# Altium project canh_nang_ha.PrjPcb
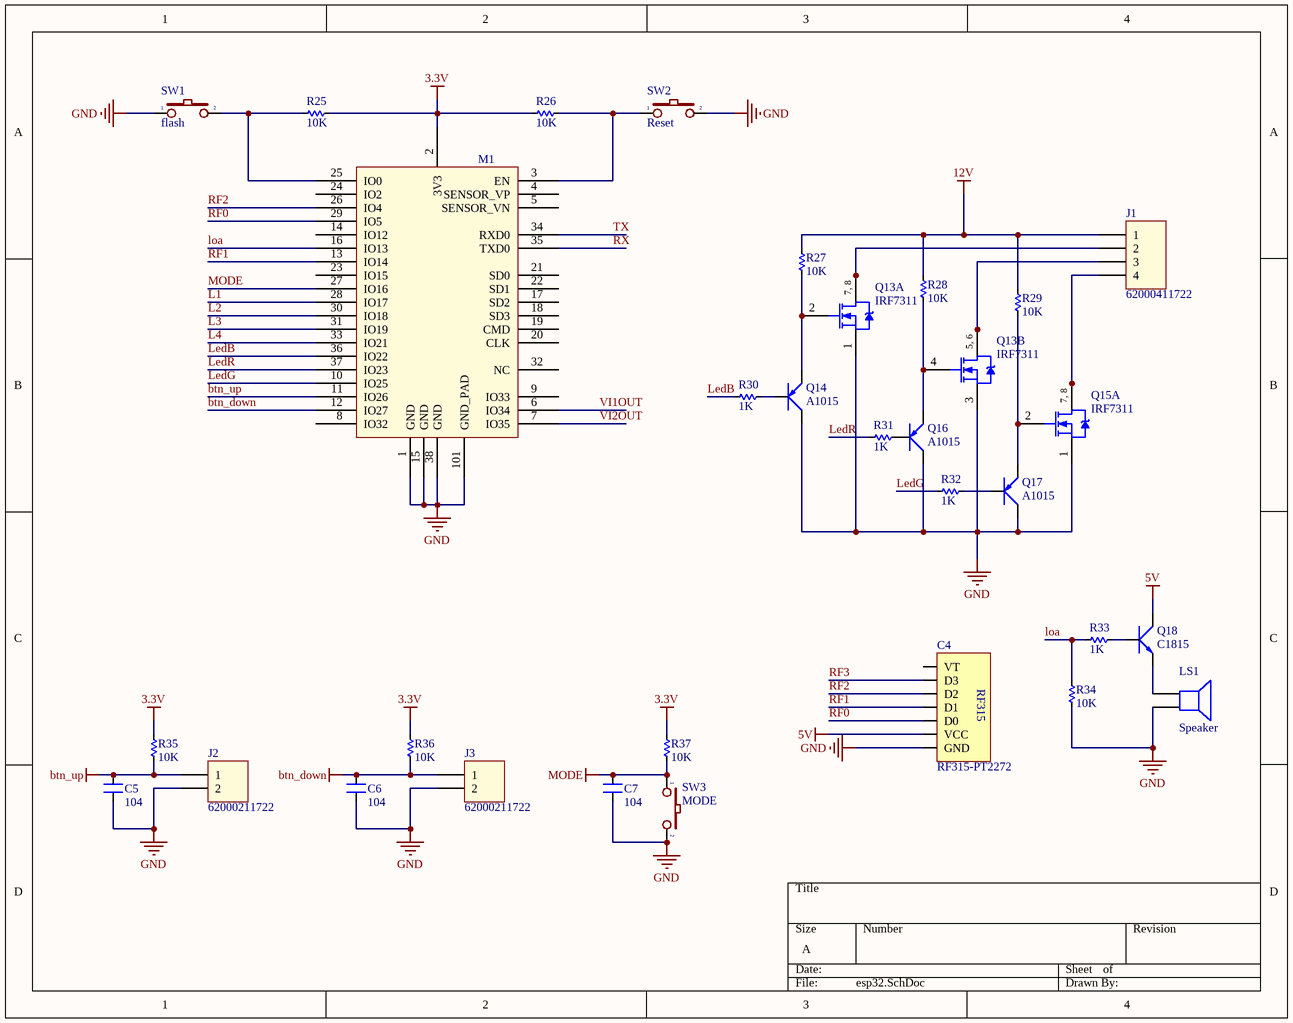
[diagram p0: esp32.SchDoc]
3 sheets, 96 parts. Net scope: global (net labels, ports and power ports of the same name join across sheets).
Board file: canh_nang_ha_pcb.PcbDoc
Sheets:
  esp32.SchDoc
  Bridge_H.SchDoc
  power.SchDoc

## Sheet esp32.SchDoc
size A

### Parts
C4  RF315-PT2272  [RF315-2272]
C5  104  [SM-CAP-0805]
C6  104  [SM-CAP-0805]
C7  104  [SM-CAP-0805]
J1  62000411722  [62000411722]
J2  62000211722  [62000211722]
J3  62000211722  [62000211722]
LS1  Speaker  [SPEAKER]
M1  ESP32S_Module  [ESP32S]  (value not drawn)
Q13  IRF7311  [SO-8_N]  (parts A,B of 2)
Q14  A1015  [SOT23B]
Q15  IRF7311  [SO-8_N]  (part A of 2)
Q16  A1015  [SOT23B]
Q17  A1015  [SOT23B]
Q18  C1815  [SOT23B]
R25  10K  [RES-SMD-0805]
R26  10K  [RES-SMD-0805]
R27  10K  [RES-SMD-0805]
R28  10K  [RES-SMD-0805]
R29  10K  [RES-SMD-0805]
R30  1K  [RES-SMD-0805]
R31  1K  [RES-SMD-0805]
R32  1K  [RES-SMD-0805]
R33  1K  [RES-SMD-0805]
R34  10K  [RES-SMD-0805]
R35  10K  [RES-SMD-0805]
R36  10K  [RES-SMD-0805]
R37  10K  [RES-SMD-0805]
SW1  flash  [SW-DIP1-1]
SW2  Reset  [SW1-SMD]
SW3  MODE  [SW-DIP1-1]

### Nets
3.3V: M1.2(3V3) R25.2 R26.1 R35.2 R36.2 R37.2
5V: C4.6(VCC) Q18.2(C)
12V: J1.1 R27.1 R28.1 R29.1
btn_down: C6.2 J3.1 M1.12(IO27) R36.1
btn_up: C5.2 J2.1 M1.11(IO26) R35.1
GND: C4.7(GND) C5.1 C6.1 C7.1 J2.2 J3.2 LS1.2 M1.1(GND) M1.15(GND) M1.38(GND) M1.101(GND_PAD) Q13.1(S) Q13.3(S) Q14.2(C) Q15.1(S) Q16.2(C) Q17.2(C) R34.2 SW1.1 SW2.2 SW3.2
MODE: C7.2 M1.27(IO16) R37.1 SW3.1
L1: M1.28(IO17)
L2: M1.30(IO18)
L3: M1.31(IO19)
L4: M1.33(IO21)
LedB: M1.36(IO22) R30.2
LedG: M1.10(IO25) R32.2
LedR: M1.37(IO23) R31.2
loa: M1.16(IO13) R33.2 R34.1
RF0: C4.5(D0) M1.29(IO5)
RF1: C4.4(D1) M1.13(IO14)
RF2: C4.3(D2) M1.26(IO4)
RF3: C4.2(D3)
RX: M1.35(TXD0)
TX: M1.34(RXD0)
VI1OUT: M1.6(IO34)
VI2OUT: M1.7(IO35)
NetJ1_2: J1.2 Q13.7(D) Q13.8(D)
NetJ1_3: J1.3 Q13.5(D) Q13.6(D)
NetJ1_4: J1.4 Q15.7(D) Q15.8(D)
NetLS1_1: LS1.1 Q18.1(E)
NetM1_3: M1.3(EN) R26.2 SW2.1
NetM1_25: M1.25(IO0) R25.1 SW1.2
NetQ13_2: Q13.2(G) Q14.1(E) R27.2
NetQ13_4: Q13.4(G) Q16.1(E) R28.2
NetQ14_3: Q14.3(B) R30.1
NetQ15_2: Q15.2(G) Q17.1(E) R29.2
NetQ16_3: Q16.3(B) R31.1
NetQ17_3: Q17.3(B) R32.1
NetQ18_3: Q18.3(B) R33.1

Not connected (* = marked no-connect by the designer): C4 1(VT); M1 4(SENSOR_VP) 5(SENSOR_VN) 8(IO32) 9(IO33) 14(IO12) 17(SD2) 18(SD3) 19(CMD) 20(CLK) 21(SD0) 22(SD1) 23(IO15) 24(IO2) 32(NC)

### Notes on the sheet
- (in symbol IRF7101, part A) 7, 8
- (in symbol IRF7101, part B) 5, 6
- (in symbol RF315-PT2272) RF315

### Library data of the parts
C4 = RF315-PT2272: Manufacturer: W¨¹rth Elektronik eiSos GmbH; partNo: 613004143121; ComponentLink1 Description: Manufacturer; ComponentLink2 Description: Datasheet; NoPins: 04; Created Date: 29 March 2013; ComponentLink1URL: http://www.we-online.com; ComponentLink2URL: http://katalog.we-online.de/em/datasheet/6130xx143121.pdf; Created by: Karrer Zheng
C5-C7 = CN: Value: 0,1uF/300V; Designed by: VanDungEvn
J1 = 62000411722: WR-WTB 2.00mm Male Horizontal Shrouded Header, 4p; Pin Number: 4; ComponentLink1Description: Manufacturer; ComponentLink1URL: http://www.we-online.de; ComponentLink2Description: Datasheet; ComponentLink2URL: http://katalog.we-online.de/em/datasheet/6200xx11722.pdf; Part Number: 62000411722; Published Date: June 2017; Publisher: Wurth Elektronik; Pitch: 2.00 mm
J2 J3 = 62000211722: WR-WTB 2.00mm Male Horizontal Shrouded Header, 2p; Pin Number: 2; ComponentLink1Description: Manufacturer; ComponentLink1URL: http://www.we-online.de; ComponentLink2Description: Datasheet; ComponentLink2URL: http://katalog.we-online.de/em/datasheet/6200xx11722.pdf; Part Number: 62000211722; Published Date: June 2017; Publisher: Wurth Elektronik; Pitch: 2.00 mm
LS1 = Speaker: Loudspeaker; Published: 24-Mar-1999; LatestRevisionDate: 17-Jul-2002; LatestRevisionNote: Re-released for DXP Platform.; PackageReference: PIN2; Publisher: Altium Limited
M1 = ESP32S_Module: Esp-32S; Datasheet: https://espressif.com/sites/default/files/documentation/esp_wroom_32_datasheet_en.pdf
Q13 Q15 = IRF7101: HEXFET Power MOSFET; Published: 8-Jun-2000; LatestRevisionDate: 13-Apr-2006; LatestRevisionNote: IPC-7351 Footprint Added.; DatasheetVersion: Aug-1997; PackageVersion: Feb-2001; PackageReference: SO-8; Publisher: Altium Limited; PackageDescription: 8-Pin Plastic Small Outline Integrated Circuit 1.27 mm Pitch; Code_JEDEC: MS-012-AA; Code_IPC: SOIC127P600-8; ComponentLink1Description: Manufacturer Link; ComponentLink1URL: http://www.irf.com/; ComponentLink2Description: Datasheet; ComponentLink2URL: http://www.irf.com/product-info/datasheets/data/irf7101.pdf
Q14 Q16 Q17 = A1015: PNP 600mW, ECB; Value: A1015
Q18 = C1815: NPN 600mW, ECB; Value: C1815
R25-R37 = Res-SMD: Resistor; Manufacturer: Generic Components; Class: Passive; Published: 08/06/2000; Publisher: Altium Hobart Technology Centre
SW1-SW3 = SW2: Switch button 2 pin; Value: SW chip 2 pin

## Sheet Bridge_H.SchDoc
size A3
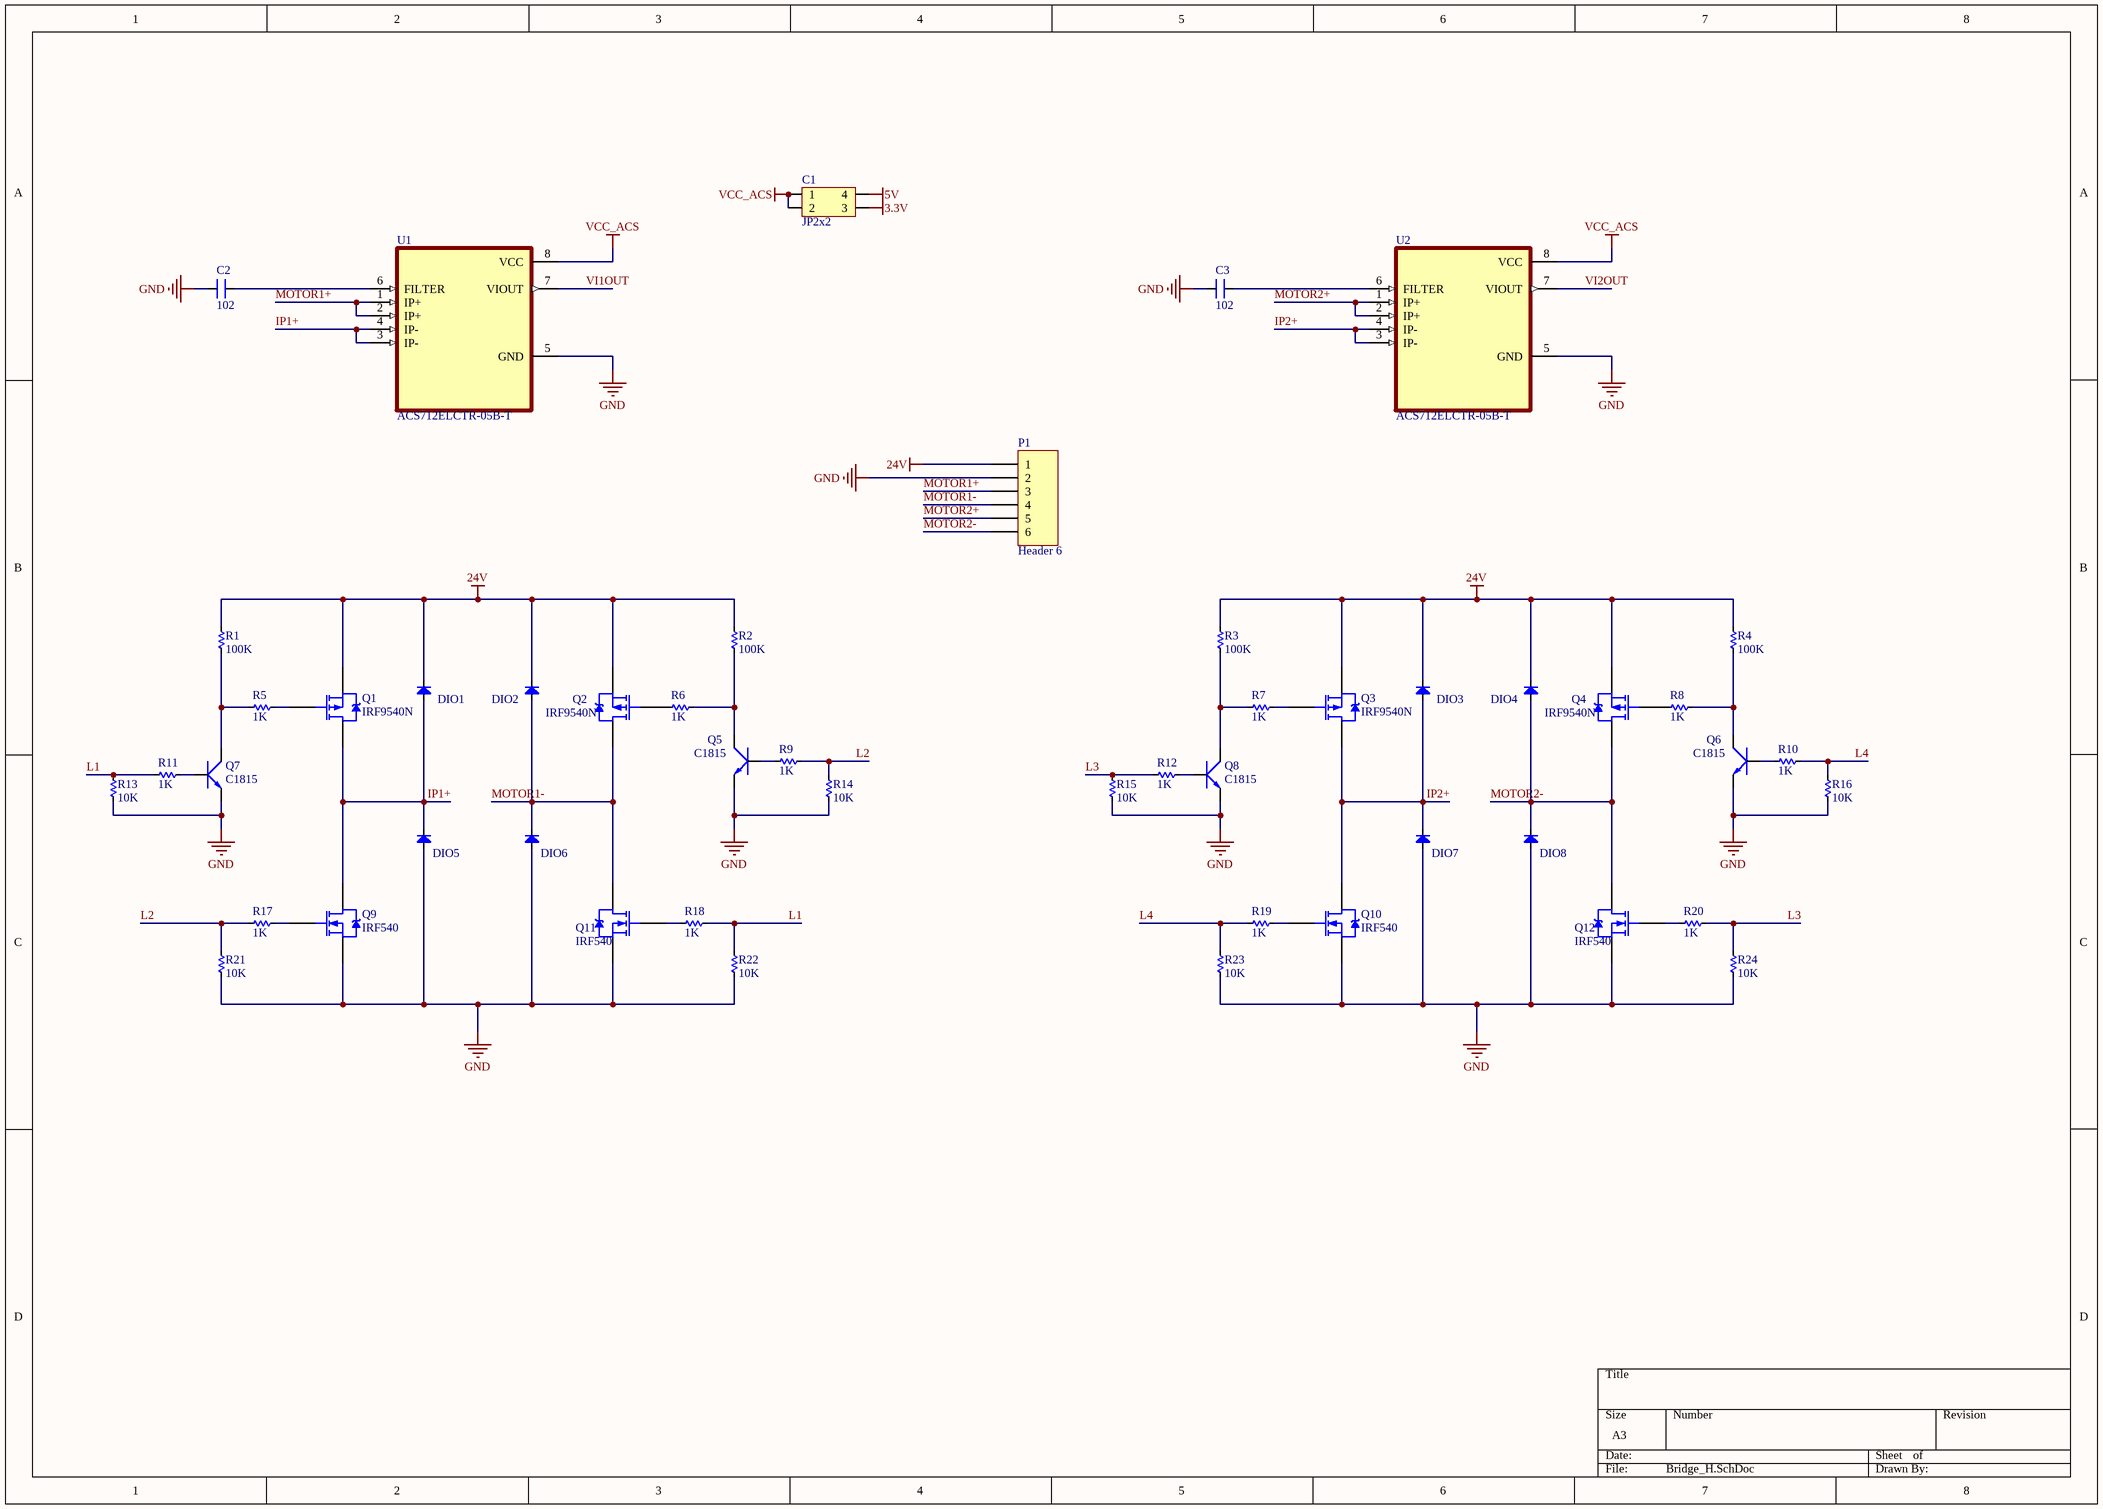
[diagram p1: Bridge_H.SchDoc]

### Parts
C1  JP2x2  [JP2-D2T]
C2  102  [SM-CAP-0805]
C3  102  [SM-CAP-0805]
DIO1  Diode SMD  [DIO-SMD-106]  (value not drawn)
DIO2  Diode SMD  [DIO-SMD-106]  (value not drawn)
DIO3  Diode SMD  [DIO-SMD-106]  (value not drawn)
DIO4  Diode SMD  [DIO-SMD-106]  (value not drawn)
DIO5  Diode SMD  [DIO-SMD-106]  (value not drawn)
DIO6  Diode SMD  [DIO-SMD-106]  (value not drawn)
DIO7  Diode SMD  [DIO-SMD-106]  (value not drawn)
DIO8  Diode SMD  [DIO-SMD-106]  (value not drawn)
P1  Header 6  [HED6T]
Q1  IRF9540N  [TO-220AB]
Q2  IRF9540N  [TO-220AB]
Q3  IRF9540N  [TO-220AB]
Q4  IRF9540N  [TO-220AB]
Q5  C1815  [SOT23B]
Q6  C1815  [SOT23B]
Q7  C1815  [SOT23B]
Q8  C1815  [SOT23B]
Q9  IRF540  [TO-220AB]
Q10  IRF540  [TO-220AB]
Q11  IRF540  [TO-220AB]
Q12  IRF540  [TO-220AB]
R1  100K  [RES-SMD-0805]
R2  100K  [RES-SMD-0805]
R3  100K  [RES-SMD-0805]
R4  100K  [RES-SMD-0805]
R5  1K  [RES-SMD-0805]
R6  1K  [RES-SMD-0805]
R7  1K  [RES-SMD-0805]
R8  1K  [RES-SMD-0805]
R9  1K  [RES-SMD-0805]
R10  1K  [RES-SMD-0805]
R11  1K  [RES-SMD-0805]
R12  1K  [RES-SMD-0805]
R13  10K  [RES-SMD-0805]
R14  10K  [RES-SMD-0805]
R15  10K  [RES-SMD-0805]
R16  10K  [RES-SMD-0805]
R17  1K  [RES-SMD-0805]
R18  1K  [RES-SMD-0805]
R19  1K  [RES-SMD-0805]
R20  1K  [RES-SMD-0805]
R21  10K  [RES-SMD-0805]
R22  10K  [RES-SMD-0805]
R23  10K  [RES-SMD-0805]
R24  10K  [RES-SMD-0805]
U1  ACS712ELCTR-05B-T  [SOIC127P600X175-8N]
U2  ACS712ELCTR-05B-T  [SOIC127P600X175-8N]

### Nets
3.3V: C1.3
5V: C1.4
24V: DIO1.2(K) DIO2.2(K) DIO3.2(K) DIO4.2(K) P1.1 Q1.3(S) Q2.3(S) Q3.3(S) Q4.3(S) R1.1 R2.1 R3.1 R4.1
GND: C2.1 C3.1 DIO5.1(A) DIO6.1(A) DIO7.1(A) DIO8.1(A) P1.2 Q5.1(E) Q6.1(E) Q7.1(E) Q8.1(E) Q9.3(S) Q10.3(S) Q11.3(S) Q12.3(S) R13.2 R14.2 R15.2 R16.2 R21.2 R22.2 R23.2 R24.2 U1.5(GND) U2.5(GND)
VCC_ACS: C1.1 C1.2 U1.8(VCC) U2.8(VCC)
IP1+: DIO1.1(A) DIO5.2(K) Q1.2(D) Q9.2(D) U1.3(IP-) U1.4(IP-)
IP2+: DIO3.1(A) DIO7.2(K) Q3.2(D) Q10.2(D) U2.3(IP-) U2.4(IP-)
L1: R11.2 R13.1 R18.1 R22.1
L2: R9.1 R14.1 R17.2 R21.1
L3: R12.2 R15.1 R20.1 R24.1
L4: R10.1 R16.1 R19.2 R23.1
MOTOR1+: P1.3 U1.1(IP+) U1.2(IP+)
MOTOR1-: DIO2.1(A) DIO6.2(K) P1.4 Q2.2(D) Q11.2(D)
MOTOR2+: P1.5 U2.1(IP+) U2.2(IP+)
MOTOR2-: DIO4.1(A) DIO8.2(K) P1.6 Q4.2(D) Q12.2(D)
VI1OUT: U1.7(VIOUT)
VI2OUT: U2.7(VIOUT)
NetC2_2: C2.2 U1.6(FILTER)
NetC3_2: C3.2 U2.6(FILTER)
NetQ1_1: Q1.1(G) R5.2
NetQ2_1: Q2.1(G) R6.1
NetQ3_1: Q3.1(G) R7.2
NetQ4_1: Q4.1(G) R8.1
NetQ5_2: Q5.2(C) R2.2 R6.2
NetQ5_3: Q5.3(B) R9.2
NetQ6_2: Q6.2(C) R4.2 R8.2
NetQ6_3: Q6.3(B) R10.2
NetQ7_2: Q7.2(C) R1.2 R5.1
NetQ7_3: Q7.3(B) R11.1
NetQ8_2: Q8.2(C) R3.2 R7.1
NetQ8_3: Q8.3(B) R12.1
NetQ9_1: Q9.1(G) R17.1
NetQ10_1: Q10.1(G) R19.1
NetQ11_1: Q11.1(G) R18.2
NetQ12_1: Q12.1(G) R20.2

### Library data of the parts
C1 = JP2x2: WR-PHD 2.54 mm Dual Socket Header; Manufacturer: W¨¹rth Elektronik eiSos GmbH; partNo: 61300421821; ComponentLink1 Description: Manufacturer; ComponentLink2 Description: Datasheet; NoPins: 04; Created Date: 29 March 2013; ComponentLink1URL: http://www.we-online.com; ComponentLink2URL: http://katalog.we-online.de/em/datasheet/6130xx21821.pdf; Created by: Karrer Zheng
C2 C3 = CN: as C5 on sheet esp32
DIO1-DIO8 = Diode SMD: Default Diode; Code - JEDEC: DO-214-AB; Value: 1N5007; Published: 8-Jun-2000; Revision: July-2002: Re-released for DXP Platform.; Publisher: Altium Limited
P1 = Header 6: Header, 6-Pin; LatestRevisionDate: 17-Jul-2002; LatestRevisionNote: Re-released for DXP Platform.; Publisher: Altium Limited
Q1-Q4 = IRF9540N: HEXFET Power MOSFET; Note: Pin 2 is electrically connected to pin 4.; Published: 8-Jun-2000; LatestRevisionDate: 17-Jul-2002; LatestRevisionNote: Re-released for DXP Platform.; DatasheetVersion: May-1998; PackageVersion: Feb-1997; PackageReference: TO-220AB; Publisher: Altium Limited; PackageDescription: TO, Thru-Hole, Vertical, Heatsink Mounted; 3 In-Line Leads; Pitch 2.54 mm; ComponentLink1Description: Manufacturer Link; ComponentLink1URL: http://www.irf.com/; ComponentLink2Description: Datasheet; ComponentLink2URL: http://www.irf.com/product-info/datasheets/data/irf9540n.pdf
Q5-Q8 = C1815: NPN 600mW, ECB; Value: C1815
Q9-Q12 = IRF540: HEXFET N-Channel Power MOSFET; Note: Pin 2 is electrically connected to pin 4.; Published: 8-Jun-2000; LatestRevisionDate: 17-Jul-2002; LatestRevisionNote: Re-released for DXP Platform.; DatasheetVersion: PD-9.373H; PackageVersion: Feb-1997; PackageReference: TO-220AB; Publisher: Altium Limited; PackageDescription: TO, Thru-Hole, Vertical, Heatsink Mounted; 3 In-Line Leads; Pitch 2.54 mm; ComponentLink1Description: Manufacturer Link; ComponentLink1URL: http://www.irf.com/
R1-R24 = Res-SMD: as R25 on sheet esp32; Published: 08/06/2000; Publisher: Altium Hobart Technology Centre
U1 U2 = ACS712ELCTR-05B-T: Current Sensor 5A 1 Channel Hall Effect, Open Loop Bidirectional 8-SOIC _0.154, 3.90mm Width_; MF: Allegro MicroSystems LLC; MP: ACS712ELCTR-05B-T; Digi-Key_Part_Number: 620-1189-1-ND; Package: SOIC-8 Allegro MicroSystems LLC; Digi-Key_Purchase_URL: https://www.digikey.in/product-detail/en/allegro-microsystems/ACS712ELCTR-05B-T/620-1189-1-ND/1284606?utm_source=snapeda&utm_medium=aggregator&utm_campaign=symbol; Value: *; SnapEDA_Link: https://www.snapeda.com/parts/ACS712ELCTR-05B-T/Allegro%20MicroSystems%20LLC/view-part/46765/?ref=snap

## Sheet power.SchDoc
size A
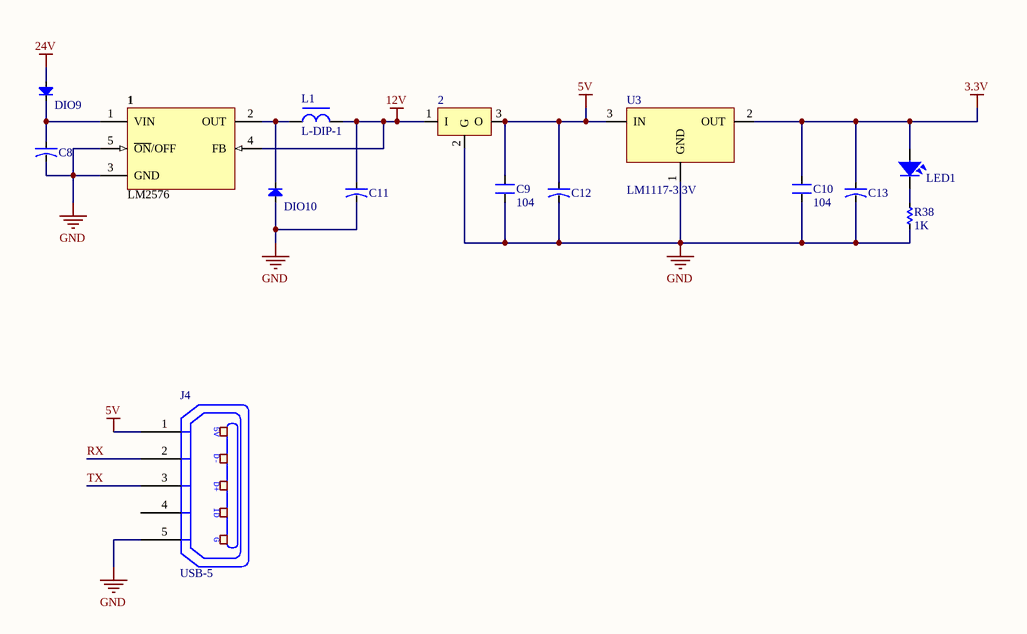
[diagram p2: power.SchDoc]

### Parts
1  LM2576  [TO263]
2  LM78xx  [TO252-123]  (value not drawn)
C8  CN-ALU-SMD  [CAP-ALU-SMD-4.5x5x1.4]  (value not drawn)
C9  104  [SM-CAP-0805]
C10  104  [SM-CAP-0805]
C11  CN-ALU-SMD  [CAP-ALU-SMD-4.5x5x1.4]  (value not drawn)
C12  CN-ALU-SMD  [CAP-ALU-SMD-4.5x5x1.4]  (value not drawn)
C13  CN-ALU-SMD  [CAP-ALU-SMD-4.5x5x1.4]  (value not drawn)
DIO9  Diode SMD  [DIO-SMD-106]  (value not drawn)
DIO10  Diode SMD  [DIO-SMD-106]  (value not drawn)
J4  USB-5  [USB-M4]
L1  L-DIP-1  [L-DIP-M-13.5x6]
LED1  LED  [LED-0805-Blue]  (value not drawn)
R38  1K  [RES-SMD-0805]
U3  LM1117-3.3V  [SOT223]

### Nets
3.3V: C10.2 C13.1 LED1.1 U3.2(OUT)
5V: 2.3(O) C9.2 C12.1 J4.1(P1) U3.3(IN)
12V: 1.4(FB) 2.1(I) C11.1 L1.2
24V: DIO9.1(A)
GND: 1.3(GND) 1.5(~{ON}/OFF) 2.2(G) C8.2 C9.1 C10.1 C11.2 C12.2 C13.2 DIO10.1(A) J4.5(P5) R38.1 U3.1(GND)
RX: J4.2(P2)
TX: J4.3(P3)
Net1_1: 1.1(VIN) C8.1 DIO9.2(K)
Net1_2: 1.2(OUT) DIO10.2(K) L1.1
NetLED1_2: LED1.2 R38.2

Not connected (* = marked no-connect by the designer): J4 4(P4)

### Notes on the sheet
- (in symbol USB-5) 5V; D-; D+; ID; G

### Library data of the parts
1 = LM2576: Max Input Voltage: 12 V; Max Output Current: 3 (6.0 peak) A; Max Output Voltage: mV; Category: IC-Power; Min Input Voltage: mV; Min Output Voltage: mV; Mounting Technology: Surface Mount; Status: Unreleased; Supply Voltage: mV; Temperature Range: -40 to +125 degC
2 = LM78xx: Positive Voltage Regulator; Note: Tab is connected to pin 3 (GND).; Published: 24-Aug-2001; LatestRevisionDate: 17-Jul-2002; LatestRevisionNote: Re-released for DXP Platform.; DatasheetVersion: Apr-1994; PackageVersion: Jul-1998; PackageReference: ISOWATT220AB; Publisher: Altium Limited; PackageDescription: TO, Thru-Hole, Vertical, Heatsink Mounted; 3 In-Line Leads; Pitch 2.54 mm; Pin sequence 1, 3, 2; ComponentLink1Description: Manufacturer Link; ComponentLink1URL: http://www.st.com/; ComponentLink2Description: Datasheet; ComponentLink2URL: http://www.st.com/stonline/products/literature/ds/2146/l78m05c.pdf
C8 C11-C13 = CN-ALU-SMD: Polarized Capacitor (Axial); Published: 8-Jun-2000; LatestRevisionDate: 17-Jul-2002; LatestRevisionNote: Re-released for DXP Platform.; PackageReference: POLAR0.8; Publisher: Altium Limited
C9 C10 = CN: as C5 on sheet esp32
DIO9 DIO10 = Diode SMD: as DIO1 on sheet Bridge_H; Published: 8-Jun-2000; Revision: July-2002: Re-released for DXP Platform.; Publisher: Altium Limited
J4 = USB-5: Manufacturer: FCI; Manufacturer Part Number: 10118193-0001LF; Connector Type: USB - micro B; Number of Contacts: 5; Gender: Receptacle; Specifications: USB 2.0; .Creator: MM; .Checked PCB: RF; Supplier 1: Digi-Key; RoHS: RoHS Compliant; Category: Connectors, Interconnects; Stock 1: 28642; Pricing 1: 1=0.46, 10=0.433, 25=0.3712, 50=0.3156, 100=0.3032, 250=0.27224, 500=0.25988 (USD); Packaging: Cut Tape (CT); Mounting Type: Surface Mount, Right Angle, Horizontal; Features: Shielded, Solder Retention; Ingress Protection: -; ComponentLink1URL: http://portal.fciconnect.com/Comergent//fci/drawing/10118193.pdf; ComponentLink1Description: http://portal.fciconnect.com/Comergent//fci/drawing/10118193.pdf; Supplier Part Number 1: 609-4616-1-ND; .Checked SCH: MM
L1 = L-DIP-1: Inductor; Value: 150 mH
LED1 = LED SMD: Value: LED 3 - 5 ly 2 Colour
R38 = Res-SMD: as R25 on sheet esp32; Published: 08/06/2000; Publisher: Altium Hobart Technology Centre
U3 = LM1117: 800mA Low-Dropout Linear Regulator; Creator: Nguyen Ba Bien; Website: http://group3i.net

## Nets that join several sheets
3.3V: esp32 (6 pins), Bridge_H (C1.3), power (C10.2 C13.1 LED1.1 U3.2)
5V: esp32 (C4.6 Q18.2), Bridge_H (C1.4), power (5 pins)
12V: esp32 (J1.1 R27.1 R28.1 R29.1), power (1.4 2.1 C11.1 L1.2)
24V: Bridge_H (13 pins), power (DIO9.1)
GND: esp32 (21 pins), Bridge_H (25 pins), power (13 pins)
L1: esp32 (M1.28), Bridge_H (R11.2 R13.1 R18.1 R22.1)
L2: esp32 (M1.30), Bridge_H (R9.1 R14.1 R17.2 R21.1)
L3: esp32 (M1.31), Bridge_H (R12.2 R15.1 R20.1 R24.1)
L4: esp32 (M1.33), Bridge_H (R10.1 R16.1 R19.2 R23.1)
RX: esp32 (M1.35), power (J4.2)
TX: esp32 (M1.34), power (J4.3)
VI1OUT: esp32 (M1.6), Bridge_H (U1.7)
VI2OUT: esp32 (M1.7), Bridge_H (U2.7)